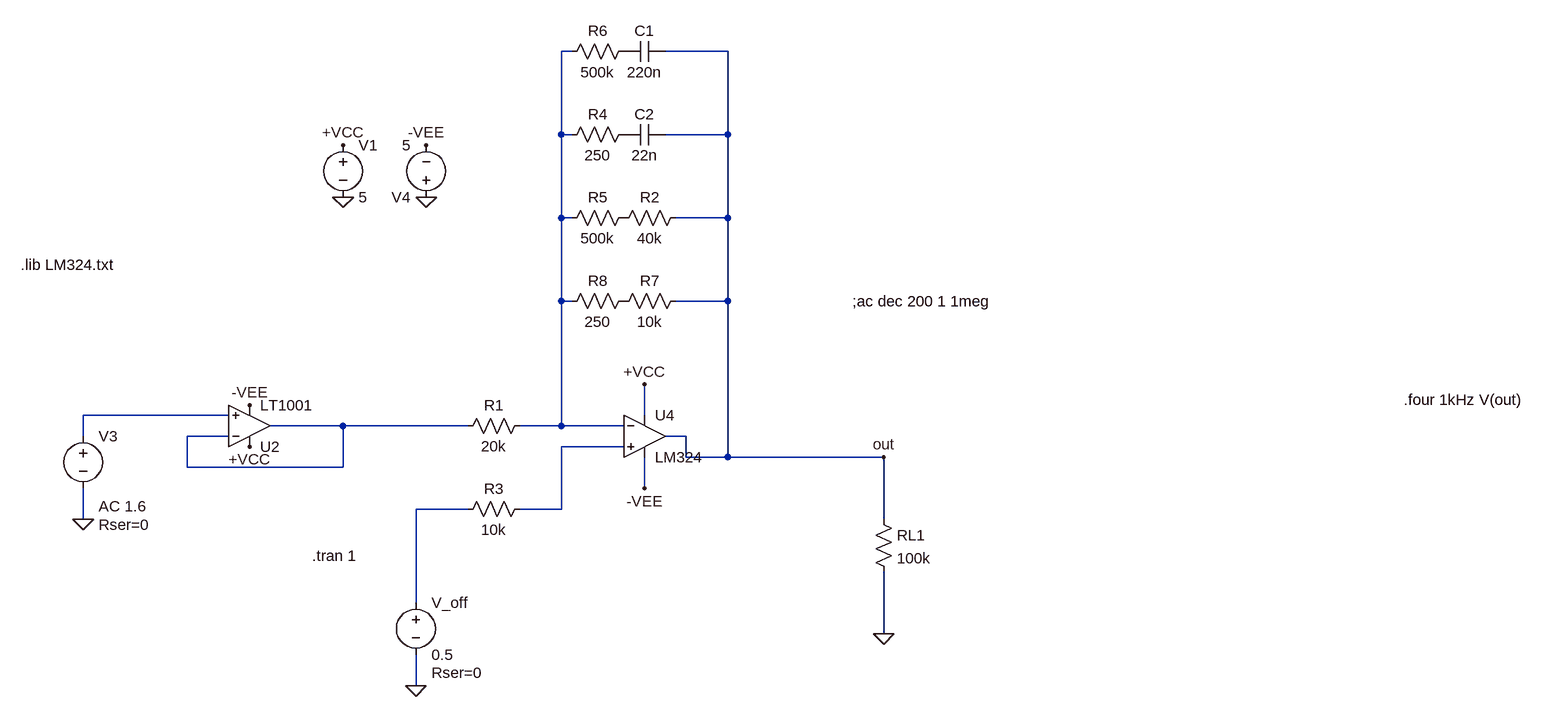
[diagram p0: schematic amplificador_dac_4016.asc]
amplificador_dac_4016.asc, the LTspice schematic file:
Version 4
SHEET 1 1920 680
WIRE 0 -480 -16 -480
WIRE 240 -480 144 -480
WIRE -16 -352 -16 -480
WIRE 0 -352 -16 -352
WIRE 240 -352 240 -480
WIRE 240 -352 144 -352
WIRE -16 -224 -16 -352
WIRE 0 -224 -16 -224
WIRE 240 -224 240 -352
WIRE 240 -224 160 -224
WIRE -16 -96 -16 -224
WIRE 0 -96 -16 -96
WIRE 240 -96 240 -224
WIRE 240 -96 160 -96
WIRE -528 80 -752 80
WIRE 112 80 112 32
WIRE -352 96 -464 96
WIRE -160 96 -352 96
WIRE -16 96 -16 -96
WIRE -16 96 -80 96
WIRE 80 96 -16 96
WIRE -752 112 -752 80
WIRE -528 112 -592 112
WIRE 176 112 144 112
WIRE 80 128 -16 128
WIRE 176 144 176 112
WIRE 240 144 240 -96
WIRE 240 144 176 144
WIRE 480 144 240 144
WIRE -592 160 -592 112
WIRE -352 160 -352 96
WIRE -352 160 -592 160
WIRE 112 192 112 144
WIRE -160 224 -240 224
WIRE -16 224 -16 128
WIRE -16 224 -80 224
WIRE -752 240 -752 192
WIRE 480 240 480 144
WIRE -240 368 -240 224
WIRE 480 416 480 320
WIRE -240 496 -240 448
FLAG 112 32 +VCC
FLAG -352 -256 0
FLAG -352 -336 +VCC
FLAG -752 240 0
FLAG -224 -256 0
FLAG -224 -336 -VEE
FLAG 112 192 -VEE
FLAG -240 496 0
FLAG -496 128 +VCC
FLAG -496 64 -VEE
FLAG 480 416 0
FLAG 480 144 out
SYMBOL voltage -352 -352 R0
WINDOW 123 0 0 Left 2
WINDOW 39 0 0 Left 2
SYMATTR InstName V1
SYMATTR Value 5
SYMBOL voltage -752 96 R0
WINDOW 123 24 124 Left 2
WINDOW 39 24 152 Left 2
WINDOW 3 24 96 Invisible 2
SYMATTR Value2 AC 1.6
SYMATTR SpiceLine Rser=0
SYMATTR Value PWL TIME_SCALE_FACTOR=0.1 VALUE_SCALE_FACTOR=1 REPEAT FOREVER (file=triangularDAC_0a3.2V_100pts.txt) ENDREPEAT
SYMATTR InstName V3
SYMBOL res -64 80 R90
WINDOW 0 0 56 VBottom 2
WINDOW 3 32 56 VTop 2
SYMATTR InstName R1
SYMATTR Value 20k
SYMBOL res 176 -240 R90
WINDOW 0 0 56 VBottom 2
WINDOW 3 32 56 VTop 2
SYMATTR InstName R2
SYMATTR Value 40k
SYMBOL voltage -224 -240 R180
WINDOW 123 0 0 Left 2
WINDOW 39 0 0 Left 2
SYMATTR InstName V4
SYMATTR Value 5
SYMBOL voltage -240 352 R0
WINDOW 123 0 0 Left 2
WINDOW 39 24 124 Left 2
SYMATTR SpiceLine Rser=0
SYMATTR InstName V_off
SYMATTR Value 0.5
SYMBOL Opamps\\LT1001 -496 160 M180
SYMATTR InstName U2
SYMBOL Opamps\\opamp2 112 48 R0
SYMATTR InstName U4
SYMATTR Value LM324
SYMBOL cap 144 -368 R90
WINDOW 0 0 32 VBottom 2
WINDOW 3 32 32 VTop 2
SYMATTR InstName C2
SYMATTR Value 22n
SYMBOL res 464 224 R0
SYMATTR InstName RL1
SYMATTR Value 100k
SYMBOL res -64 208 R90
WINDOW 0 0 56 VBottom 2
WINDOW 3 32 56 VTop 2
SYMATTR InstName R3
SYMATTR Value 10k
SYMBOL res 96 -368 R90
WINDOW 0 0 56 VBottom 2
WINDOW 3 32 56 VTop 2
SYMATTR InstName R4
SYMATTR Value 250
SYMBOL res 96 -240 R90
WINDOW 0 0 56 VBottom 2
WINDOW 3 32 56 VTop 2
SYMATTR InstName R5
SYMATTR Value 500k
SYMBOL cap 144 -496 R90
WINDOW 0 0 32 VBottom 2
WINDOW 3 32 32 VTop 2
SYMATTR InstName C1
SYMATTR Value 220n
SYMBOL res 96 -496 R90
WINDOW 0 0 56 VBottom 2
WINDOW 3 32 56 VTop 2
SYMATTR InstName R6
SYMATTR Value 500k
SYMBOL res 176 -112 R90
WINDOW 0 0 56 VBottom 2
WINDOW 3 32 56 VTop 2
SYMATTR InstName R7
SYMATTR Value 10k
SYMBOL res 96 -112 R90
WINDOW 0 0 56 VBottom 2
WINDOW 3 32 56 VTop 2
SYMATTR InstName R8
SYMATTR Value 250
TEXT -400 296 Left 2 !.tran 1
TEXT -848 -152 Left 2 !.lib LM324.txt
TEXT 432 -96 Left 2 !;ac dec 200 1 1meg
TEXT 1280 56 Left 2 !.four 1kHz V(out)

The netlist it stands for:
* amplificador_dac_4016.asc
V1 +VCC 0 5
V3 N002 0 PWL TIME_SCALE_FACTOR=0.1 VALUE_SCALE_FACTOR=1 REPEAT FOREVER (file=triangularDAC_0a3.2V_100pts.txt) ENDREPEAT AC 1.6 Rser=0
R1 N001 N003 20k
R2 out P001 40k
V4 0 -VEE 5
V_off N005 0 0.5 Rser=0
XU2 N002 N003 +VCC -VEE N003 LT1001  ; pins In+ In- V+ V- OUT
XU4 N004 N001 +VCC -VEE out LM324  ; pins In+ In- V+ V- OUT
C2 out P002 22n
RL1 out 0 100k
R3 N004 N005 10k
R4 P002 N001 250
R5 P001 N001 500k
C1 out P003 220n
R6 P003 N001 500k
R7 out P004 10k
R8 P004 N001 250
.tran 1
.lib LM324.txt
;ac dec 200 1 1meg
.four 1kHz V(out)
.lib LTC.lib
.backanno
.end